# Altium project PCB_Project 0817.PrjPCB
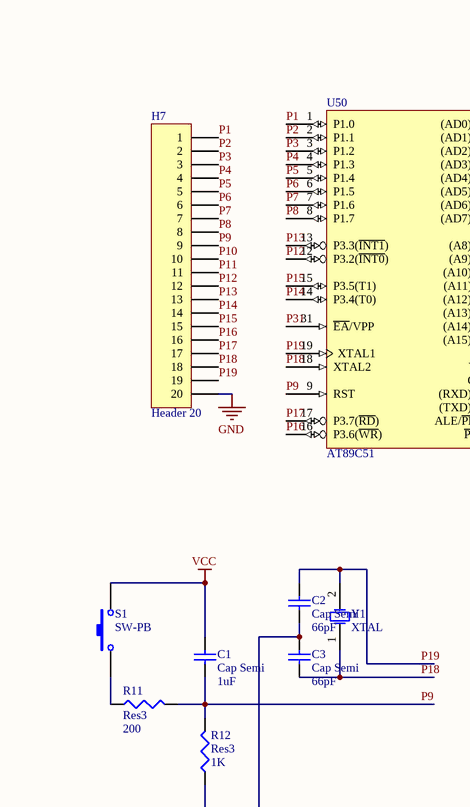
[diagram p0: Sheet 0817.SchDoc, top left]
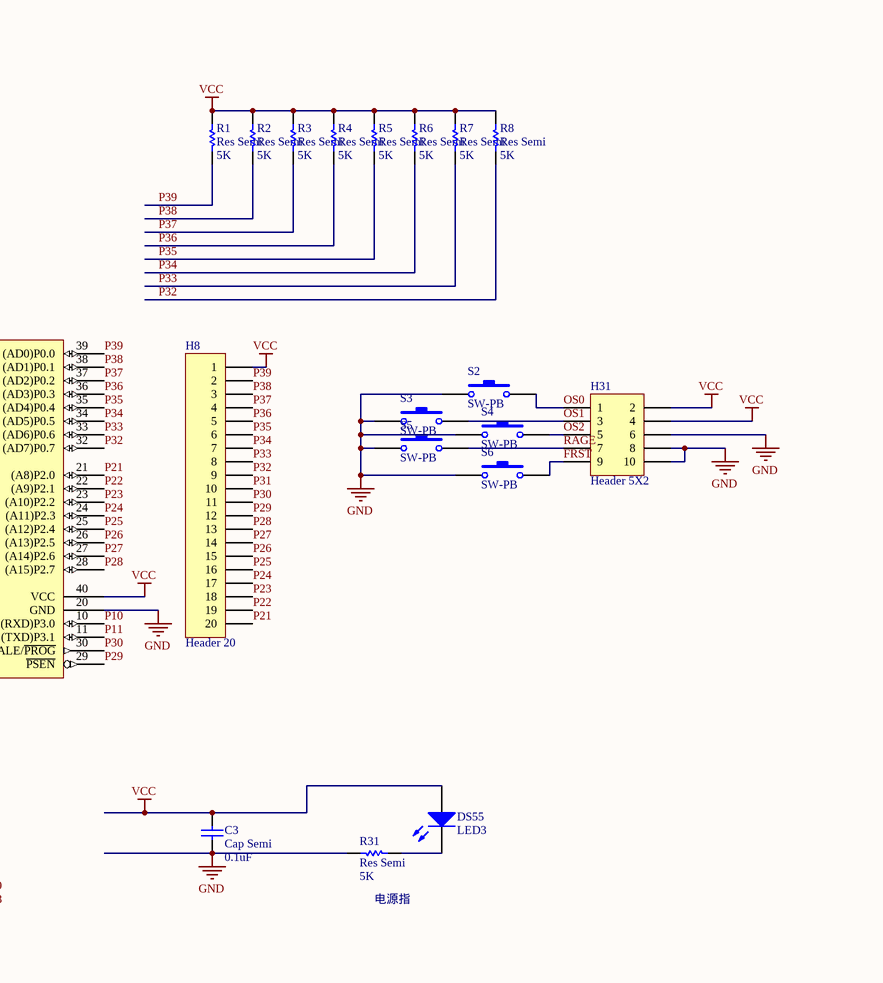
[diagram p1: Sheet 0817.SchDoc, top middle]
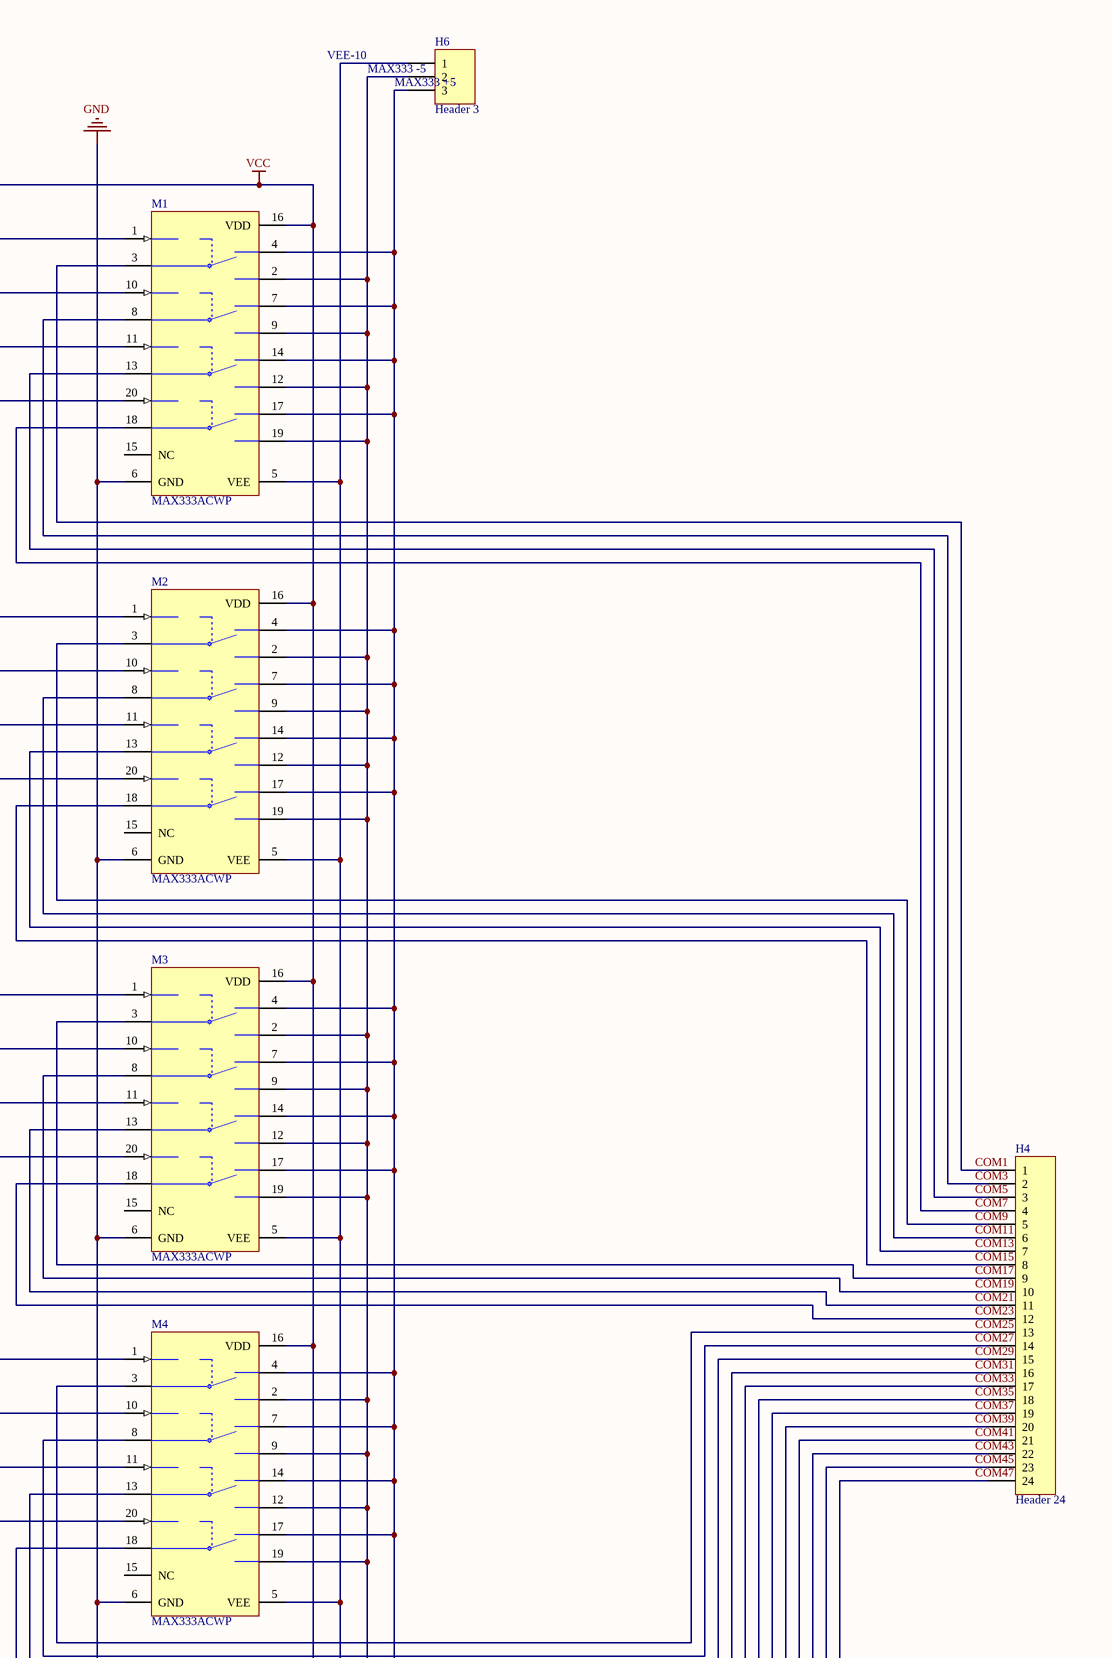
[diagram p2: Sheet 0817.SchDoc, top right]
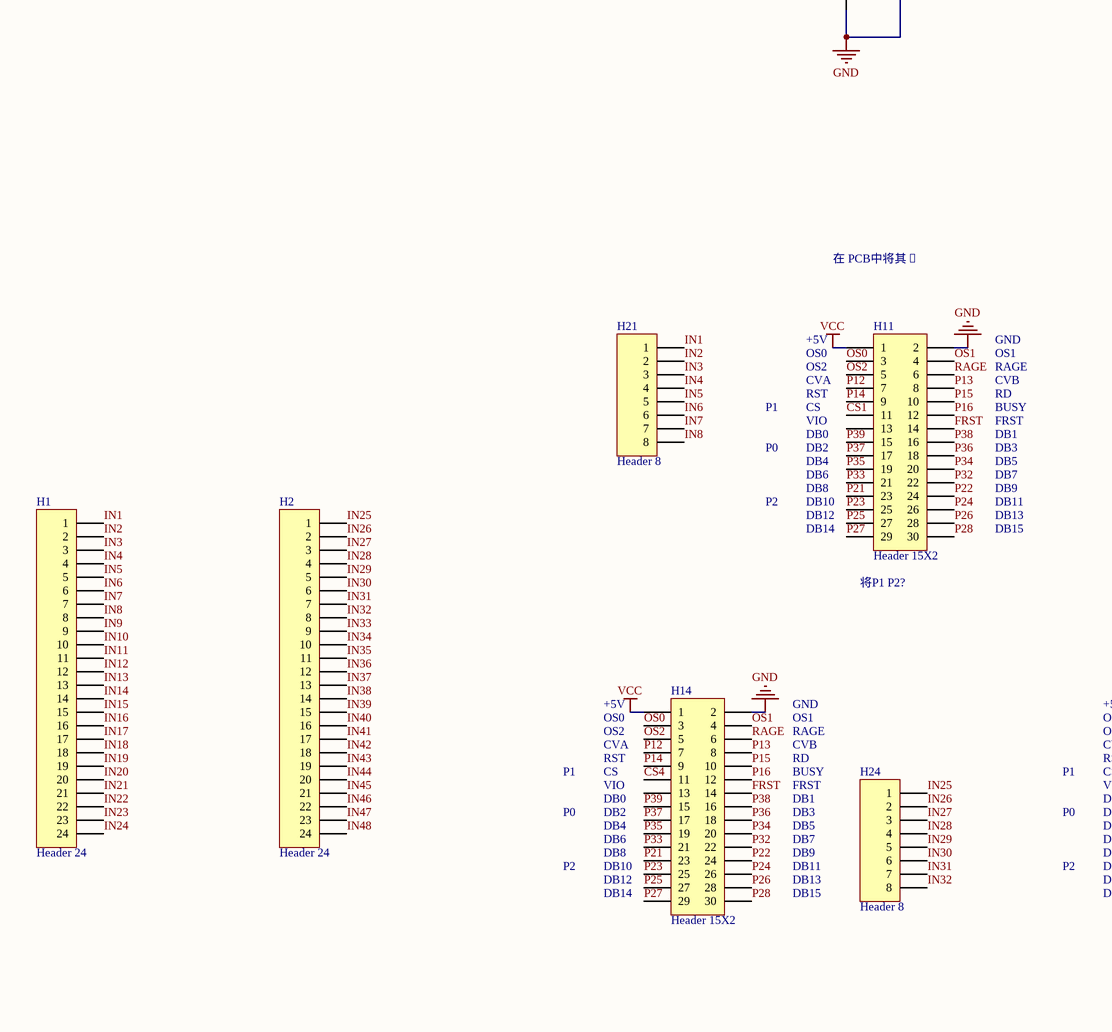
[diagram p3: Sheet 0817.SchDoc, centre left]
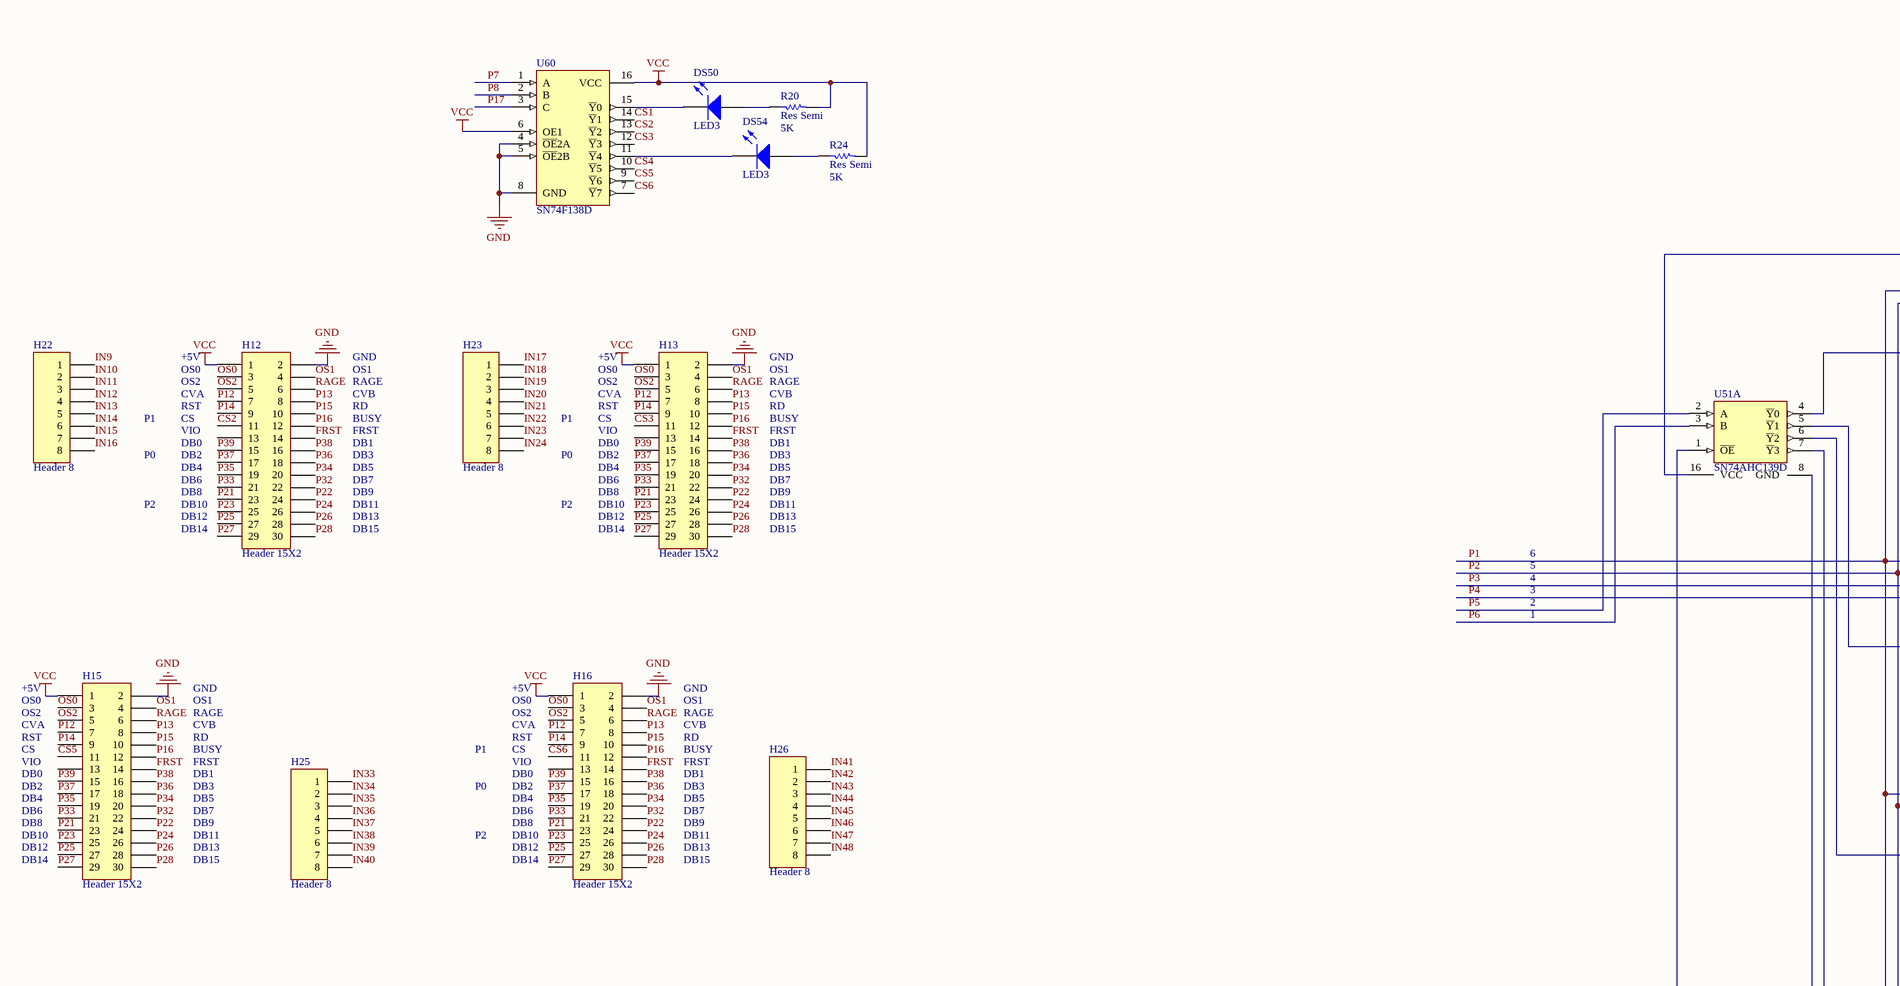
[diagram p4: Sheet 0817.SchDoc, centre middle]
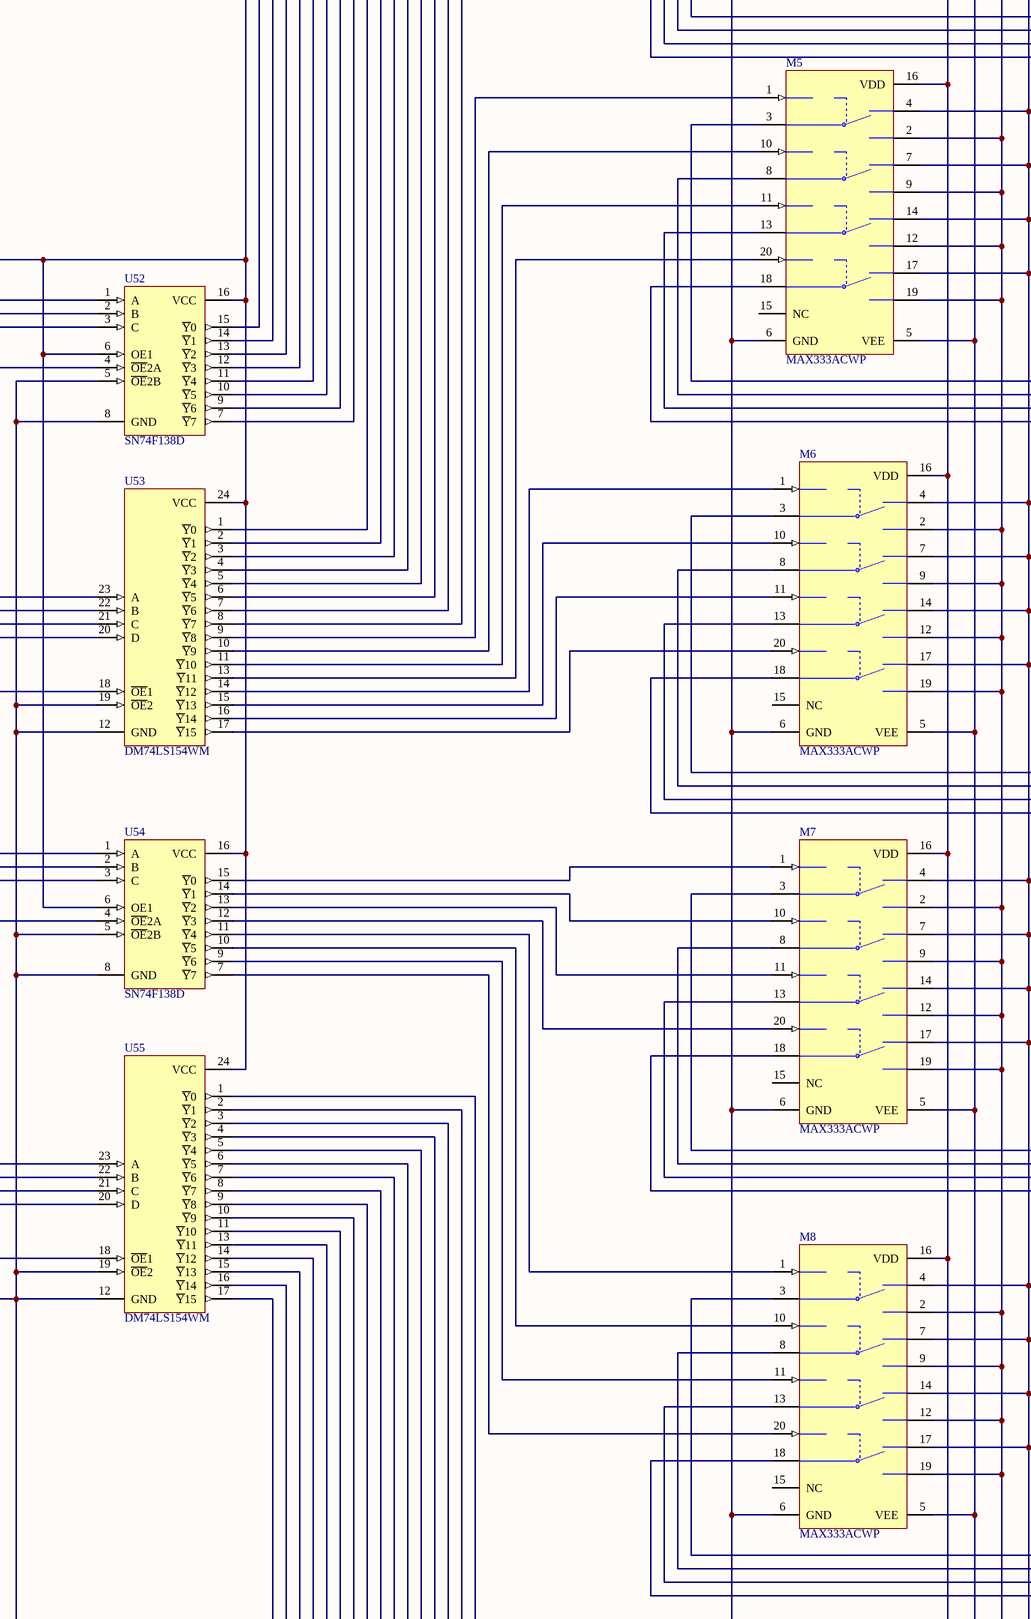
[diagram p5: Sheet 0817.SchDoc, centre right]
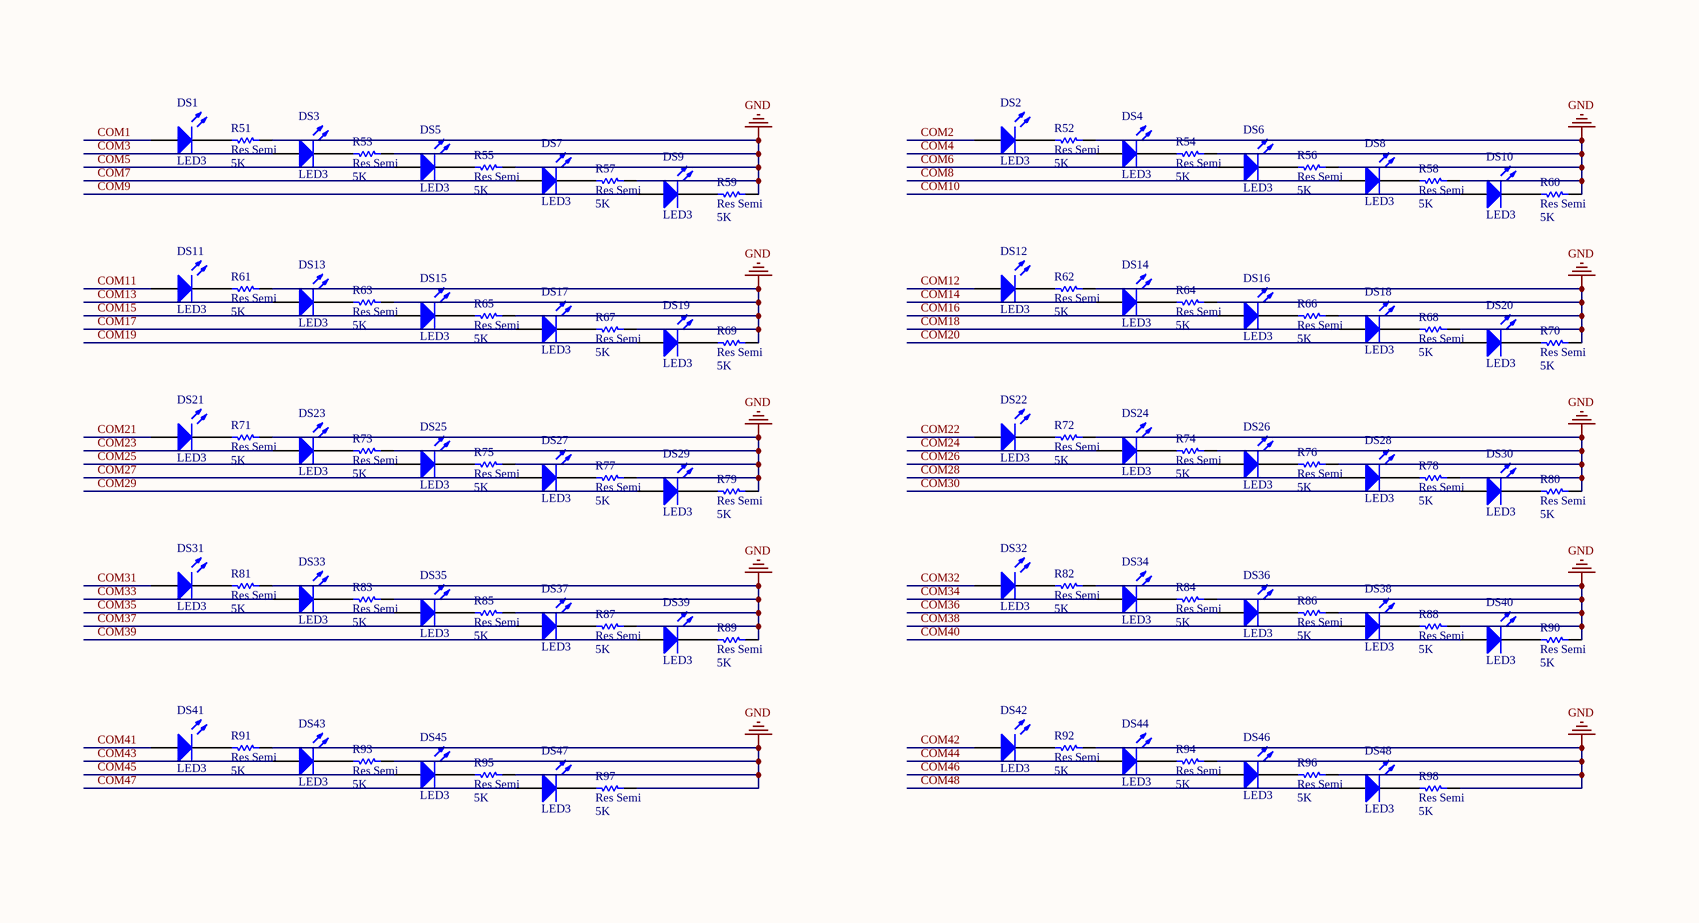
[diagram p6: Sheet 0817.SchDoc, bottom middle]
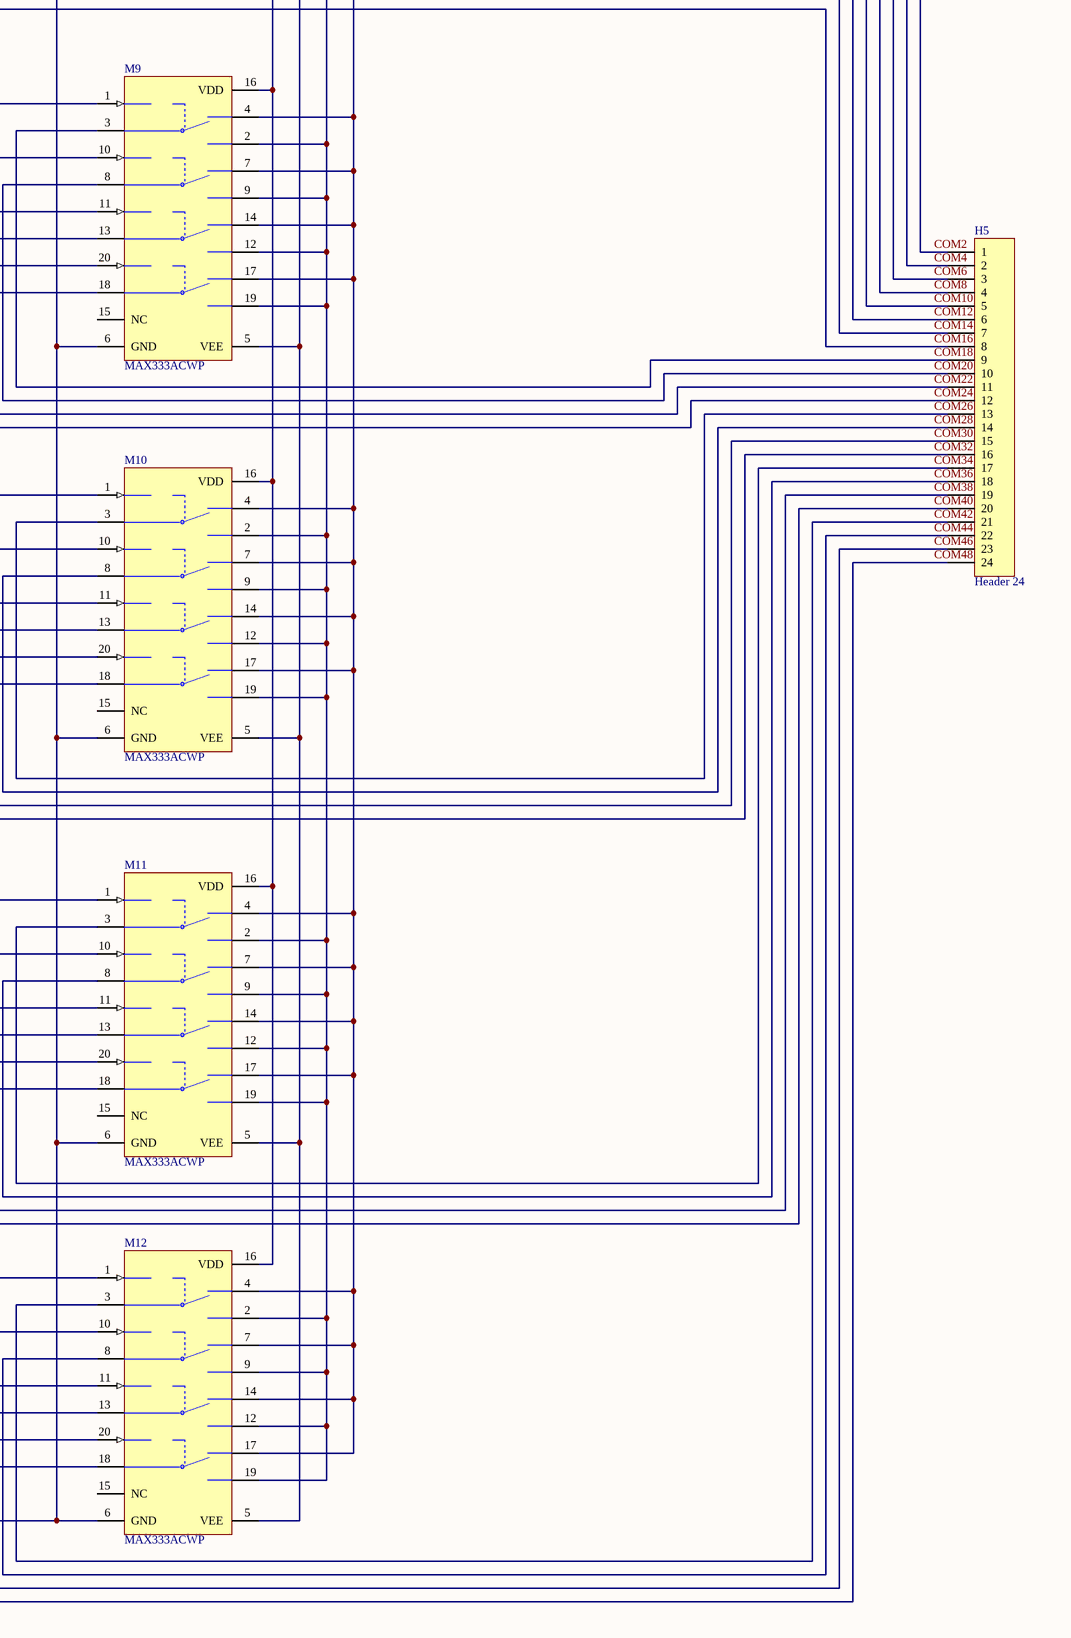
[diagram p7: Sheet 0817.SchDoc, bottom right]
1 sheet, 162 parts. Net scope: global (net labels, ports and power ports of the same name join across sheets).
Board file: PCB 0901.PcbDoc

## Sheet Sheet 0817.SchDoc
size 1651 x 1651 mm

### Parts
(Parts that share a designator on the sheet are numbered #1, #2 ... from top to bottom, then left to right.)
C1  Cap Semi  value 1uF  [CC3216-1206]
C2  Cap Semi  value 66pF  [CC3216-1206]
C3#1  Cap Semi  value 0.1uF  [CC3216-1206]
C3#2  Cap Semi  value 66pF  [CC3216-1206]
DS1  LED3  [SMD _LED]
DS2  LED3  [SMD _LED]
DS3  LED3  [SMD _LED]
DS4  LED3  [SMD _LED]
DS5  LED3  [SMD _LED]
DS6  LED3  [SMD _LED]
DS7  LED3  [SMD _LED]
DS8  LED3  [SMD _LED]
DS9  LED3  [SMD _LED]
DS10  LED3  [SMD _LED]
DS11  LED3  [SMD _LED]
DS12  LED3  [SMD _LED]
DS13  LED3  [SMD _LED]
DS14  LED3  [SMD _LED]
DS15  LED3  [SMD _LED]
DS16  LED3  [SMD _LED]
DS17  LED3  [SMD _LED]
DS18  LED3  [SMD _LED]
DS19  LED3  [SMD _LED]
DS20  LED3  [SMD _LED]
DS21  LED3  [SMD _LED]
DS22  LED3  [SMD _LED]
DS23  LED3  [SMD _LED]
DS24  LED3  [SMD _LED]
DS25  LED3  [SMD _LED]
DS26  LED3  [SMD _LED]
DS27  LED3  [SMD _LED]
DS28  LED3  [SMD _LED]
DS29  LED3  [SMD _LED]
DS30  LED3  [SMD _LED]
DS31  LED3  [SMD _LED]
DS32  LED3  [SMD _LED]
DS33  LED3  [SMD _LED]
DS34  LED3  [SMD _LED]
DS35  LED3  [SMD _LED]
DS36  LED3  [SMD _LED]
DS37  LED3  [SMD _LED]
DS38  LED3  [SMD _LED]
DS39  LED3  [SMD _LED]
DS40  LED3  [SMD _LED]
DS41  LED3  [SMD _LED]
DS42  LED3  [SMD _LED]
DS43  LED3  [SMD _LED]
DS44  LED3  [SMD _LED]
DS45  LED3  [SMD _LED]
DS46  LED3  [SMD _LED]
DS47  LED3  [SMD _LED]
DS48  LED3  [SMD _LED]
DS50  LED3  [SMD _LED]
DS54  LED3  [SMD _LED]
DS55  LED3  [SMD _LED]
H1  Header 24  [HDR1X24]
H2  Header 24  [HDR1X24]
H4  Header 24  [HDR1X24]
H5  Header 24  [HDR1X24]
H6  Header 3  [HDR1X3]
H7  Header 20  [HDR1X20]
H8  Header 20  [HDR1X20]
H11  Header 15X2  [HDR2X15]
H12  Header 15X2  [HDR2X15]
H13  Header 15X2  [HDR2X15]
H14  Header 15X2  [HDR2X15]
H15  Header 15X2  [HDR2X15]
H16  Header 15X2  [HDR2X15]
H21  Header 8  [HDR1X8]
H22  Header 8  [HDR1X8]
H23  Header 8  [HDR1X8]
H24  Header 8  [HDR1X8]
H25  Header 8  [HDR1X8]
H26  Header 8  [HDR1X8]
H31  Header 5X2  [HDR2X5]
M1  MAX333ACWP  [WSO20]
M2  MAX333ACWP  [WSO20]
M3  MAX333ACWP  [WSO20]
M4  MAX333ACWP  [WSO20]
M5  MAX333ACWP  [WSO20]
M6  MAX333ACWP  [WSO20]
M7  MAX333ACWP  [WSO20]
M8  MAX333ACWP  [WSO20]
M9  MAX333ACWP  [WSO20]
M10  MAX333ACWP  [WSO20]
M11  MAX333ACWP  [WSO20]
M12  MAX333ACWP  [WSO20]
R1  Res Semi  value 5K  [CR2012-0805]
R2  Res Semi  value 5K  [CR2012-0805]
R3  Res Semi  value 5K  [CR2012-0805]
R4  Res Semi  value 5K  [CR2012-0805]
R5  Res Semi  value 5K  [CR2012-0805]
R6  Res Semi  value 5K  [CR2012-0805]
R7  Res Semi  value 5K  [CR2012-0805]
R8  Res Semi  value 5K  [CR2012-0805]
R11  Res3  value 200  [C1608-0603]
R12  Res3  value 1K  [C1608-0603]
R20  Res Semi  value 5K  [CR2012-0805]
R24  Res Semi  value 5K  [CR2012-0805]
R31  Res Semi  value 5K  [CR2012-0805]
R51  Res Semi  value 5K  [CR2012-0805]
R52  Res Semi  value 5K  [CR2012-0805]
R53  Res Semi  value 5K  [CR2012-0805]
R54  Res Semi  value 5K  [CR2012-0805]
R55  Res Semi  value 5K  [CR2012-0805]
R56  Res Semi  value 5K  [CR2012-0805]
R57  Res Semi  value 5K  [CR2012-0805]
R58  Res Semi  value 5K  [CR2012-0805]
R59  Res Semi  value 5K  [CR2012-0805]
R60  Res Semi  value 5K  [CR2012-0805]
R61  Res Semi  value 5K  [CR2012-0805]
R62  Res Semi  value 5K  [CR2012-0805]
R63  Res Semi  value 5K  [CR2012-0805]
R64  Res Semi  value 5K  [CR2012-0805]
R65  Res Semi  value 5K  [CR2012-0805]
R66  Res Semi  value 5K  [CR2012-0805]
R67  Res Semi  value 5K  [CR2012-0805]
R68  Res Semi  value 5K  [CR2012-0805]
R69  Res Semi  value 5K  [CR2012-0805]
R70  Res Semi  value 5K  [CR2012-0805]
R71  Res Semi  value 5K  [CR2012-0805]
R72  Res Semi  value 5K  [CR2012-0805]
R73  Res Semi  value 5K  [CR2012-0805]
R74  Res Semi  value 5K  [CR2012-0805]
R75  Res Semi  value 5K  [CR2012-0805]
R76  Res Semi  value 5K  [CR2012-0805]
R77  Res Semi  value 5K  [CR2012-0805]
R78  Res Semi  value 5K  [CR2012-0805]
R79  Res Semi  value 5K  [CR2012-0805]
R80  Res Semi  value 5K  [CR2012-0805]
R81  Res Semi  value 5K  [CR2012-0805]
R82  Res Semi  value 5K  [CR2012-0805]
R83  Res Semi  value 5K  [CR2012-0805]
R84  Res Semi  value 5K  [CR2012-0805]
R85  Res Semi  value 5K  [CR2012-0805]
R86  Res Semi  value 5K  [CR2012-0805]
R87  Res Semi  value 5K  [CR2012-0805]
R88  Res Semi  value 5K  [CR2012-0805]
R89  Res Semi  value 5K  [CR2012-0805]
R90  Res Semi  value 5K  [CR2012-0805]
R91  Res Semi  value 5K  [CR2012-0805]
R92  Res Semi  value 5K  [CR2012-0805]
R93  Res Semi  value 5K  [CR2012-0805]
R94  Res Semi  value 5K  [CR2012-0805]
R95  Res Semi  value 5K  [CR2012-0805]
R96  Res Semi  value 5K  [CR2012-0805]
R97  Res Semi  value 5K  [CR2012-0805]
R98  Res Semi  value 5K  [CR2012-0805]
S1  SW-PB  [SPST-2]
S2  SW-PB  [SPST-2]
S3  SW-PB  [SPST-2]
S4  SW-PB  [SPST-2]
S5  SW-PB  [SPST-2]
S6  SW-PB  [SPST-2]
U50  AT89C51  [40P6]
U51  SN74AHC139D  [D016]  (part A of 2)
U52  SN74F138D  [D016]
U53  DM74LS154WM  [M24B]
U54  SN74F138D  [D016]
U55  DM74LS154WM  [M24B]
U60  SN74F138D  [D016]
Y1  XTAL  [BCY-W2/D3.1]

### Nets
GND: C2.2 C3#1.1 C3#2.1 H7.20 H11.2 H12.2 H13.2 H14.2 H15.2 H16.2 H31.6 H31.8 H31.10 M1.6(GND) M2.6(GND) M3.6(GND) M4.6(GND) M5.6(GND) M6.6(GND) M7.6(GND) M8.6(GND) M9.6(GND) M10.6(GND) M11.6(GND) M12.6(GND) R12.1 R31.1 R51.2 R52.2 R53.2 R54.2 R55.2 R56.2 R57.2 R58.2 R59.2 R60.2 R61.2 R62.2 R63.2 R64.2 R65.2 R66.2 R67.2 R68.2 R69.2 R70.2 R71.2 R72.2 R73.2 R74.2 R75.2 R76.2 R77.2 R78.2 R79.2 R80.2 R81.2 R82.2 R83.2 R84.2 R85.2 R86.2 R87.2 R88.2 R89.2 R90.2 R91.2 R92.2 R93.2 R94.2 R95.2 R96.2 R97.2 R98.2 S2.1 S3.1 S4.1 S5.1 S6.1 U50.20(GND) U51.1(~{OE}) U51.8(GND) U52.5(~{OE}2B) U52.8(GND) U53.12(GND) U53.19(~{OE}2) U54.5(~{OE}2B) U54.8(GND) U55.12(GND) U55.19(~{OE}2) U60.4(~{OE}2A) U60.5(~{OE}2B) U60.8(GND)
VCC: C1.1 C3#1.2 DS55.1(A) H8.1 H11.1 H12.1 H13.1 H14.1 H15.1 H16.1 H31.2 H31.4 M1.16(VDD) M2.16(VDD) M3.16(VDD) M4.16(VDD) M5.16(VDD) M6.16(VDD) M7.16(VDD) M8.16(VDD) M9.16(VDD) M10.16(VDD) M11.16(VDD) M12.16(VDD) R1.1 R2.1 R3.1 R4.1 R5.1 R6.1 R7.1 R8.1 R20.2 R24.2 S1.2 U50.40(VCC) U51.16(VCC) U52.6(OE1) U52.16(VCC) U53.24(VCC) U54.6(OE1) U54.16(VCC) U55.24(VCC) U60.6(OE1) U60.16(VCC)
COM1: DS1.1(A) H4.1 M1.3(COM1)
COM2: DS2.1(A) H5.1 M7.3(COM1)
COM3: DS3.1(A) H4.2 M1.8(COM2)
COM4: DS4.1(A) H5.2 M7.8(COM2)
COM5: DS5.1(A) H4.3 M1.13(COM3)
COM6: DS6.1(A) H5.3 M7.13(COM3)
COM7: DS7.1(A) H4.4 M1.18(COM4)
COM8: DS8.1(A) H5.4 M7.18(COM4)
COM9: DS9.1(A) H4.5 M2.3(COM1)
COM10: DS10.1(A) H5.5 M8.3(COM1)
COM11: DS11.1(A) H4.6 M2.8(COM2)
COM12: DS12.1(A) H5.6 M8.8(COM2)
COM13: DS13.1(A) H4.7 M2.13(COM3)
COM14: DS14.1(A) H5.7 M8.13(COM3)
COM15: DS15.1(A) H4.8 M2.18(COM4)
COM16: DS16.1(A) H5.8 M8.18(COM4)
COM17: DS17.1(A) H4.9 M3.3(COM1)
COM18: DS18.1(A) H5.9 M9.3(COM1)
COM19: DS19.1(A) H4.10 M3.8(COM2)
COM20: DS20.1(A) H5.10 M9.8(COM2)
COM21: DS21.1(A) H4.11 M3.13(COM3)
COM22: DS22.1(A) H5.11 M9.13(COM3)
COM23: DS23.1(A) H4.12 M3.18(COM4)
COM24: DS24.1(A) H5.12 M9.18(COM4)
COM25: DS25.1(A) H4.13 M4.3(COM1)
COM26: DS26.1(A) H5.13 M10.3(COM1)
COM27: DS27.1(A) H4.14 M4.8(COM2)
COM28: DS28.1(A) H5.14 M10.8(COM2)
COM29: DS29.1(A) H4.15 M4.13(COM3)
COM30: DS30.1(A) H5.15 M10.13(COM3)
COM31: DS31.1(A) H4.16 M4.18(COM4)
COM32: DS32.1(A) H5.16 M10.18(COM4)
COM33: DS33.1(A) H4.17 M5.3(COM1)
COM34: DS34.1(A) H5.17 M11.3(COM1)
COM35: DS35.1(A) H4.18 M5.8(COM2)
COM36: DS36.1(A) H5.18 M11.8(COM2)
COM37: DS37.1(A) H4.19 M5.13(COM3)
COM38: DS38.1(A) H5.19 M11.13(COM3)
COM39: DS39.1(A) H4.20 M5.18(COM4)
COM40: DS40.1(A) H5.20 M11.18(COM4)
COM41: DS41.1(A) H4.21 M6.3(COM1)
COM42: DS42.1(A) H5.21 M12.3(COM1)
COM43: DS43.1(A) H4.22 M6.8(COM2)
COM44: DS44.1(A) H5.22 M12.8(COM2)
COM45: DS45.1(A) H4.23 M6.13(COM3)
COM46: DS46.1(A) H5.23 M12.13(COM3)
COM47: DS47.1(A) H4.24 M6.18(COM4)
COM48: DS48.1(A) H5.24 M12.18(COM4)
CS1: H11.11 U60.14(~{Y}1)
CS2: H12.11 U60.13(~{Y}2)
CS3: H13.11 U60.12(~{Y}3)
CS4: H14.11 U60.10(~{Y}5)
CS5: H15.11 U60.9(~{Y}6)
CS6: H16.11 U60.7(~{Y}7)
FRST: H11.14 H12.14 H13.14 H14.14 H15.14 H16.14 H31.9 S6.2
IN1: H1.1 H21.1
IN2: H1.2 H21.2
IN3: H1.3 H21.3
IN4: H1.4 H21.4
IN5: H1.5 H21.5
IN6: H1.6 H21.6
IN7: H1.7 H21.7
IN8: H1.8 H21.8
IN9: H1.9 H22.1
IN10: H1.10 H22.2
IN11: H1.11 H22.3
IN12: H1.12 H22.4
IN13: H1.13 H22.5
IN14: H1.14 H22.6
IN15: H1.15 H22.7
IN16: H1.16 H22.8
IN17: H1.17 H23.1
IN18: H1.18 H23.2
IN19: H1.19 H23.3
IN20: H1.20 H23.4
IN21: H1.21 H23.5
IN22: H1.22 H23.6
IN23: H1.23 H23.7
IN24: H1.24 H23.8
IN25: H2.1 H24.1
IN26: H2.2 H24.2
IN27: H2.3 H24.3
IN28: H2.4 H24.4
IN29: H2.5 H24.5
IN30: H2.6 H24.6
IN31: H2.7 H24.7
IN32: H2.8 H24.8
IN33: H2.9 H25.1
IN34: H2.10 H25.2
IN35: H2.11 H25.3
IN36: H2.12 H25.4
IN37: H2.13 H25.5
IN38: H2.14 H25.6
IN39: H2.15 H25.7
IN40: H2.16 H25.8
IN41: H2.17 H26.1
IN42: H2.18 H26.2
IN43: H2.19 H26.3
IN44: H2.20 H26.4
IN45: H2.21 H26.5
IN46: H2.22 H26.6
IN47: H2.23 H26.7
IN48: H2.24 H26.8
OS0: H11.3 H12.3 H13.3 H14.3 H15.3 H16.3 H31.1 S2.2
OS1: H11.4 H12.4 H13.4 H14.4 H15.4 H16.4 H31.3 S3.2
OS2: H11.5 H12.5 H13.5 H14.5 H15.5 H16.5 H31.5 S4.2
P1: H7.1 U50.1(P1.0) U52.1(A) U53.23(A) U54.1(A) U55.23(A)
P2: H7.2 U50.2(P1.1) U52.2(B) U53.22(B) U54.2(B) U55.22(B)
P3: H7.3 U50.3(P1.2) U52.3(C) U53.21(C) U54.3(C) U55.21(C)
P4: H7.4 U50.4(P1.3) U53.20(D) U55.20(D)
P5: H7.5 U50.5(P1.4) U51.2(A)
P6: H7.6 U50.6(P1.5) U51.3(B)
P7: H7.7 U50.7(P1.6) U60.1(A)
P8: H7.8 U50.8(P1.7) U60.2(B)
P9: C1.2 H7.9 R11.2 R12.2 U50.9(RST)
P10: H7.10 U50.10((RXD)P3.0)
P11: H7.11 U50.11((TXD)P3.1)
P12: H7.12 H11.7 H12.7 H13.7 H14.7 H15.7 H16.7 U50.12(P3.2(~{INT0}))
P13: H7.13 H11.8 H12.8 H13.8 H14.8 H15.8 H16.8 U50.13(P3.3(~{INT1}))
P14: H7.14 H11.9 H12.9 H13.9 H14.9 H15.9 H16.9 U50.14(P3.4(T0))
P15: H7.15 H11.10 H12.10 H13.10 H14.10 H15.10 H16.10 U50.15(P3.5(T1))
P16: H7.16 H11.12 H12.12 H13.12 H14.12 H15.12 H16.12 U50.16(P3.6(~{WR}))
P17: H7.17 U50.17(P3.7(~{RD})) U60.3(C)
P18: C3#2.2 H7.18 U50.18(XTAL2) Y1.1(OSC1)
P19: C2.1 H7.19 U50.19(XTAL1) Y1.2(OSC2)
P21: H8.20 H11.23 H12.23 H13.23 H14.23 H15.23 H16.23 U50.21((A8)P2.0)
P22: H8.19 H11.24 H12.24 H13.24 H14.24 H15.24 H16.24 U50.22((A9)P2.1)
P23: H8.18 H11.25 H12.25 H13.25 H14.25 H15.25 H16.25 U50.23((A10)P2.2)
P24: H8.17 H11.26 H12.26 H13.26 H14.26 H15.26 H16.26 U50.24((A11)P2.3)
P25: H8.16 H11.27 H12.27 H13.27 H14.27 H15.27 H16.27 U50.25((A12)P2.4)
P26: H8.15 H11.28 H12.28 H13.28 H14.28 H15.28 H16.28 U50.26((A13)P2.5)
P27: H8.14 H11.29 H12.29 H13.29 H14.29 H15.29 H16.29 U50.27((A14)P2.6)
P28: H8.13 H11.30 H12.30 H13.30 H14.30 H15.30 H16.30 U50.28((A15)P2.7)
P29: H8.12 U50.29(~{PSEN})
P30: H8.11 U50.30(ALE/~{PROG})
P31: H8.10 U50.31(~{EA}/VPP)
P32: H8.9 H11.22 H12.22 H13.22 H14.22 H15.22 H16.22 R8.2 U50.32((AD7)P0.7)
P33: H8.8 H11.21 H12.21 H13.21 H14.21 H15.21 H16.21 R7.2 U50.33((AD6)P0.6)
P34: H8.7 H11.20 H12.20 H13.20 H14.20 H15.20 H16.20 R6.2 U50.34((AD5)P0.5)
P35: H8.6 H11.19 H12.19 H13.19 H14.19 H15.19 H16.19 R5.2 U50.35((AD4)P0.4)
P36: H8.5 H11.18 H12.18 H13.18 H14.18 H15.18 H16.18 R4.2 U50.36((AD3)P0.3)
P37: H8.4 H11.17 H12.17 H13.17 H14.17 H15.17 H16.17 R3.2 U50.37((AD2)P0.2)
P38: H8.3 H11.16 H12.16 H13.16 H14.16 H15.16 H16.16 R2.2 U50.38((AD1)P0.1)
P39: H8.2 H11.15 H12.15 H13.15 H14.15 H15.15 H16.15 R1.2 U50.39((AD0)P0.0)
RAGE: H11.6 H12.6 H13.6 H14.6 H15.6 H16.6 H31.7 S5.2
NetDS1_2: DS1.2(K) R51.1
NetDS2_2: DS2.2(K) R52.1
NetDS3_2: DS3.2(K) R53.1
NetDS4_2: DS4.2(K) R54.1
NetDS5_2: DS5.2(K) R55.1
NetDS6_2: DS6.2(K) R56.1
NetDS7_2: DS7.2(K) R57.1
NetDS8_2: DS8.2(K) R58.1
NetDS9_2: DS9.2(K) R59.1
NetDS10_2: DS10.2(K) R60.1
NetDS11_2: DS11.2(K) R61.1
NetDS12_2: DS12.2(K) R62.1
NetDS13_2: DS13.2(K) R63.1
NetDS14_2: DS14.2(K) R64.1
NetDS15_2: DS15.2(K) R65.1
NetDS16_2: DS16.2(K) R66.1
NetDS17_2: DS17.2(K) R67.1
NetDS18_2: DS18.2(K) R68.1
NetDS19_2: DS19.2(K) R69.1
NetDS20_2: DS20.2(K) R70.1
NetDS21_2: DS21.2(K) R71.1
NetDS22_2: DS22.2(K) R72.1
NetDS23_2: DS23.2(K) R73.1
NetDS24_2: DS24.2(K) R74.1
NetDS25_2: DS25.2(K) R75.1
NetDS26_2: DS26.2(K) R76.1
NetDS27_2: DS27.2(K) R77.1
NetDS28_2: DS28.2(K) R78.1
NetDS29_2: DS29.2(K) R79.1
NetDS30_2: DS30.2(K) R80.1
NetDS31_2: DS31.2(K) R81.1
NetDS32_2: DS32.2(K) R82.1
NetDS33_2: DS33.2(K) R83.1
NetDS34_2: DS34.2(K) R84.1
NetDS35_2: DS35.2(K) R85.1
NetDS36_2: DS36.2(K) R86.1
NetDS37_2: DS37.2(K) R87.1
NetDS38_2: DS38.2(K) R88.1
NetDS39_2: DS39.2(K) R89.1
NetDS40_2: DS40.2(K) R90.1
NetDS41_2: DS41.2(K) R91.1
NetDS42_2: DS42.2(K) R92.1
NetDS43_2: DS43.2(K) R93.1
NetDS44_2: DS44.2(K) R94.1
NetDS45_2: DS45.2(K) R95.1
NetDS46_2: DS46.2(K) R96.1
NetDS47_2: DS47.2(K) R97.1
NetDS48_2: DS48.2(K) R98.1
NetDS50_1: DS50.1(A) R20.1
NetDS50_2: DS50.2(K) U60.15(~{Y}0)
NetDS54_1: DS54.1(A) R24.1
NetDS54_2: DS54.2(K) U60.11(~{Y}4)
NetDS55_2: DS55.2(K) R31.2
NetH6_1: H6.1 M1.5(VEE) M2.5(VEE) M3.5(VEE) M4.5(VEE) M5.5(VEE) M6.5(VEE) M7.5(VEE) M8.5(VEE) M9.5(VEE) M10.5(VEE) M11.5(VEE) M12.5(VEE)
NetH6_2: H6.2 M1.2(NO1) M1.9(NO2) M1.12(NO3) M1.19(NO4) M2.2(NO1) M2.9(NO2) M2.12(NO3) M2.19(NO4) M3.2(NO1) M3.9(NO2) M3.12(NO3) M3.19(NO4) M4.2(NO1) M4.9(NO2) M4.12(NO3) M4.19(NO4) M5.2(NO1) M5.9(NO2) M5.12(NO3) M5.19(NO4) M6.2(NO1) M6.9(NO2) M6.12(NO3) M6.19(NO4) M7.2(NO1) M7.9(NO2) M7.12(NO3) M7.19(NO4) M8.2(NO1) M8.9(NO2) M8.12(NO3) M8.19(NO4) M9.2(NO1) M9.9(NO2) M9.12(NO3) M9.19(NO4) M10.2(NO1) M10.9(NO2) M10.12(NO3) M10.19(NO4) M11.2(NO1) M11.9(NO2) M11.12(NO3) M11.19(NO4) M12.2(NO1) M12.9(NO2) M12.12(NO3) M12.19(NO4)
NetH6_3: H6.3 M1.4(NC1) M1.7(NC2) M1.14(NC3) M1.17(NC4) M2.4(NC1) M2.7(NC2) M2.14(NC3) M2.17(NC4) M3.4(NC1) M3.7(NC2) M3.14(NC3) M3.17(NC4) M4.4(NC1) M4.7(NC2) M4.14(NC3) M4.17(NC4) M5.4(NC1) M5.7(NC2) M5.14(NC3) M5.17(NC4) M6.4(NC1) M6.7(NC2) M6.14(NC3) M6.17(NC4) M7.4(NC1) M7.7(NC2) M7.14(NC3) M7.17(NC4) M8.4(NC1) M8.7(NC2) M8.14(NC3) M8.17(NC4) M9.4(NC1) M9.7(NC2) M9.14(NC3) M9.17(NC4) M10.4(NC1) M10.7(NC2) M10.14(NC3) M10.17(NC4) M11.4(NC1) M11.7(NC2) M11.14(NC3) M11.17(NC4) M12.4(NC1) M12.7(NC2) M12.14(NC3) M12.17(NC4)
NetM1_1: M1.1(IN1) U52.15(~{Y}0)
NetM1_10: M1.10(IN2) U52.14(~{Y}1)
NetM1_11: M1.11(IN3) U52.13(~{Y}2)
NetM1_20: M1.20(IN4) U52.12(~{Y}3)
NetM2_1: M2.1(IN1) U52.11(~{Y}4)
NetM2_10: M2.10(IN2) U52.10(~{Y}5)
NetM2_11: M2.11(IN3) U52.9(~{Y}6)
NetM2_20: M2.20(IN4) U52.7(~{Y}7)
NetM3_1: M3.1(IN1) U53.1(~{Y}0)
NetM3_10: M3.10(IN2) U53.2(~{Y}1)
NetM3_11: M3.11(IN3) U53.3(~{Y}2)
NetM3_20: M3.20(IN4) U53.4(~{Y}3)
NetM4_1: M4.1(IN1) U53.5(~{Y}4)
NetM4_10: M4.10(IN2) U53.6(~{Y}5)
NetM4_11: M4.11(IN3) U53.7(~{Y}6)
NetM4_20: M4.20(IN4) U53.8(~{Y}7)
NetM5_1: M5.1(IN1) U53.9(~{Y}8)
NetM5_10: M5.10(IN2) U53.10(~{Y}9)
NetM5_11: M5.11(IN3) U53.11(~{Y}10)
NetM5_20: M5.20(IN4) U53.13(~{Y}11)
NetM6_1: M6.1(IN1) U53.14(~{Y}12)
NetM6_10: M6.10(IN2) U53.15(~{Y}13)
NetM6_11: M6.11(IN3) U53.16(~{Y}14)
NetM6_20: M6.20(IN4) U53.17(~{Y}15)
NetM7_1: M7.1(IN1) U54.15(~{Y}0)
NetM7_10: M7.10(IN2) U54.14(~{Y}1)
NetM7_11: M7.11(IN3) U54.13(~{Y}2)
NetM7_20: M7.20(IN4) U54.12(~{Y}3)
NetM8_1: M8.1(IN1) U54.11(~{Y}4)
NetM8_10: M8.10(IN2) U54.10(~{Y}5)
NetM8_11: M8.11(IN3) U54.9(~{Y}6)
NetM8_20: M8.20(IN4) U54.7(~{Y}7)
NetM9_1: M9.1(IN1) U55.1(~{Y}0)
NetM9_10: M9.10(IN2) U55.2(~{Y}1)
NetM9_11: M9.11(IN3) U55.3(~{Y}2)
NetM9_20: M9.20(IN4) U55.4(~{Y}3)
NetM10_1: M10.1(IN1) U55.5(~{Y}4)
NetM10_10: M10.10(IN2) U55.6(~{Y}5)
NetM10_11: M10.11(IN3) U55.7(~{Y}6)
NetM10_20: M10.20(IN4) U55.8(~{Y}7)
NetM11_1: M11.1(IN1) U55.9(~{Y}8)
NetM11_10: M11.10(IN2) U55.10(~{Y}9)
NetM11_11: M11.11(IN3) U55.11(~{Y}10)
NetM11_20: M11.20(IN4) U55.13(~{Y}11)
NetM12_1: M12.1(IN1) U55.14(~{Y}12)
NetM12_10: M12.10(IN2) U55.15(~{Y}13)
NetM12_11: M12.11(IN3) U55.16(~{Y}14)
NetM12_20: M12.20(IN4) U55.17(~{Y}15)
NetR11_1: R11.1 S1.1
NetU51_4: U51.4(~{Y}0) U52.4(~{OE}2A)
NetU51_5: U51.5(~{Y}1) U53.18(~{OE}1)
NetU51_6: U51.6(~{Y}2) U54.4(~{OE}2A)
NetU51_7: U51.7(~{Y}3) U55.18(~{OE}1)

Not connected (* = marked no-connect by the designer): H11 13; H12 13; H13 13; H14 13; H15 13; H16 13; M1 15(NC); M2 15(NC); M3 15(NC); M4 15(NC); M5 15(NC); M6 15(NC); M7 15(NC); M8 15(NC); M9 15(NC); M10 15(NC); M11 15(NC); M12 15(NC)

### Notes on the sheet
- VEE-10
- (near H6) MAX333 -5
- (near H6) MAX333 +5
- (near R31) 电源指
- 在 PCB中将其�
- (near H11) +5V
- (near H11) OS0
- (near H11) OS2
- (near H11) CVA
- (near H11) RST
- GND
- OS1
- RAGE
- CVB
- RD
- (near H12) +5V
- (near H12) OS0
- (near H12) OS2
- (near H12) CVA
- (near H12) RST
- (near H13) +5V
- (near H13) OS0
- (near H13) OS2
- (near H13) CVA
- (near H13) RST
- P0
- P1
- CS
- (near H11) VIO
- (near H11) DB0
- (near H11) DB2
- (near H11) DB4
- BUSY
- FRST
- DB1
- DB3
- DB5
- (near H12) VIO
- (near H12) DB0
- (near H12) DB2
- (near H12) DB4
- (near H13) VIO
- (near H13) DB0
- (near H13) DB2
- (near H13) DB4
- P2
- (near H11) DB6
- (near H11) DB8
- (near H11) DB10
- (near H11) DB12
- (near H11) DB14
- DB7
- DB9
- DB11
- DB13
- DB15
- (near H12) DB6
- (near H12) DB8
- (near H12) DB10
- (near H12) DB12
- (near H12) DB14
- (near H13) DB6
- (near H13) DB8
- (near H13) DB10
- (near H13) DB12
- (near H13) DB14
- (near H11) 将P1 P2?
- 6
- 5
- 4
- 3
- 2
- 1
- (near H14) +5V
- (near H14) OS0
- (near H14) OS2
- (near H15) +5V
- (near H15) OS0
- (near H15) OS2
- (near H16) +5V
- (near H16) OS0
- (near H16) OS2
- (near H14) CVA
- (near H14) RST
- (near H14) VIO
- (near H14) DB0
- (near H15) CVA
- (near H15) RST
- (near H15) VIO
- (near H15) DB0
- (near H16) CVA
- (near H16) RST
- (near H16) VIO
- (near H16) DB0
- (near H14) DB2
- (near H14) DB4
- (near H14) DB6
- (near H14) DB8
- (near H14) DB10
- (near H15) DB2
- (near H15) DB4
- (near H15) DB6
- (near H15) DB8
- (near H15) DB10
- (near H16) DB2
- (near H16) DB4
- (near H16) DB6
- (near H16) DB8
- (near H16) DB10
- (near H14) DB12
- (near H14) DB14
- (near H15) DB12
- (near H15) DB14
- (near H16) DB12
- (near H16) DB14

### Library data of the parts
C1 C2 C3#1 C3#2 = Cap Semi: Capacitor (Semiconductor SIM Model); Published: 8-Jun-2000; LatestRevisionDate: 17-Jul-2002; LatestRevisionNote: Re-released for DXP Platform.; PackageReference: C1206; Publisher: Altium Limited
DS1-DS48 DS50 DS54 DS55 = LED3: Typical BLUE SiC LED; Published: 8-Jun-2000; LatestRevisionDate: 17-Dec-2003; LatestRevisionNote: PCB Footprint replaced.; Publisher: Altium Limited
H1 H2 H4 H5 = Header 24: Header, 24-Pin; LatestRevisionDate: 17-Jul-2002; LatestRevisionNote: Re-released for DXP Platform.; Publisher: Altium Limited
H6 = Header 3: Header, 3-Pin; LatestRevisionDate: 17-Jul-2002; LatestRevisionNote: Re-released for DXP Platform.; Publisher: Altium Limited
H7 H8 = Header 20: Header, 20-Pin; LatestRevisionDate: 17-Jul-2002; LatestRevisionNote: Re-released for DXP Platform.; Publisher: Altium Limited
H11-H16 = Header 15X2: Header, 15-Pin, Dual row; LatestRevisionDate: 17-Jul-2002; LatestRevisionNote: Re-released for DXP Platform.; Publisher: Altium Limited
H21-H26 = Header 8: Header, 8-Pin; LatestRevisionDate: 17-Jul-2002; LatestRevisionNote: Re-released for DXP Platform.; Publisher: Altium Limited
H31 = Header 5X2: Header, 5-Pin, Dual row; LatestRevisionDate: 17-Jul-2002; LatestRevisionNote: Re-released for DXP Platform.; Publisher: Altium Limited
M1-M12 = MAX333ACWP: Precision, Quad, SPDT, CMOS Analog Switch; Published: 16-Jan-2001; LatestRevisionDate: 17-Jul-2002; LatestRevisionNote: Re-released for DXP Platform.; DatasheetDocument: Jun-1999; PackageReference: WSO20; Publisher: Altium Limited; Code_JEDEC: MS-013-AC; Code_IPC: SO20W
R1-R8 R20 R24 R31 R51-R98 = Res Semi: Semiconductor Resistor; Published: 8-Jun-2000; LatestRevisionDate: 17-Jul-2002; LatestRevisionNote: Re-released for DXP Platform.; Publisher: Altium Limited
R11 R12 = Res3: Resistor; Published: 8-Jun-2000; LatestRevisionDate: 17-Jul-2002; LatestRevisionNote: Re-released for DXP Platform.; Publisher: Altium Limited
S1-S6 = SW-PB: Switch; Published: 24-Mar-1999; LatestRevisionDate: 17-Jul-2002; LatestRevisionNote: Re-released for DXP Platform.; Publisher: Altium Limited
U50 = AT89C51: 8-Bit Microcontroller with 4K Flash ROM
U51 = SN74AHC139D: Dual 2-Line to 4-Line Decoder / Demultiplexer; Published: 8-Jun-2000; LatestRevisionDate: 17-Jul-2002; LatestRevisionNote: Re-released for DXP Platform.; DatasheetDocument: Jul-1998; PackageDocument: Jan-1998; PackageReference: D016; Publisher: Altium Limited
U52 U54 U60 = SN74F138D: 3-Line to 8-Line Decoder / Demultiplexer; Published: 8-Jun-2000; LatestRevisionDate: 17-Jul-2002; LatestRevisionNote: Re-released for DXP Platform.; DatasheetDocument: Jul-1996; PackageDocument: Jan-1998; PackageReference: D016; Publisher: Altium Limited
U53 U55 = DM74LS154WM: 4-Line to 16-Line Decoder/Demultiplexer; PackageDocument: 2000; Note: Generic Simulation model provided.; Published: 17-Jul-2002; DatasheetDocument: Mar-1998; PackageReference: M24B; Publisher: Altium Limited; Code_IPC: SO24W
Y1 = XTAL: Crystal Oscillator; Published: 8-Jun-2000; LatestRevisionDate: 17-Jul-2002; LatestRevisionNote: Re-released for DXP Platform.; Publisher: Altium Limited